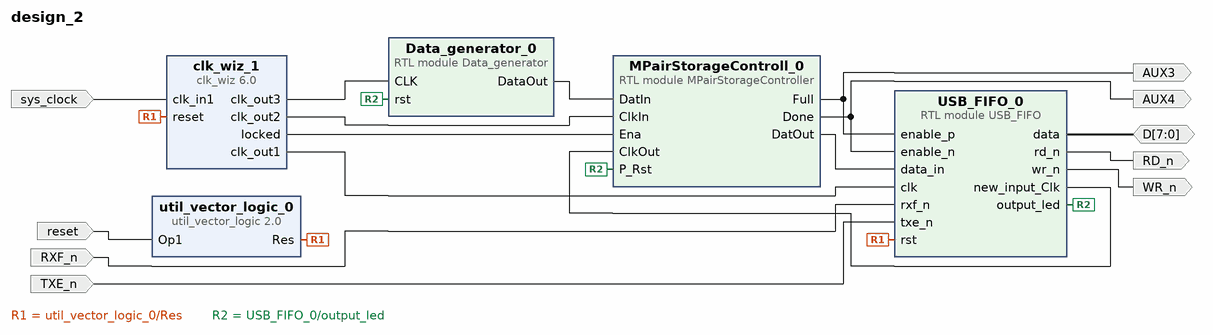
[diagram p0: block diagram of the top level]
# Vivado block design design_2, xc7a35tcsg324-2, Vivado 2019.1
create_bd_design design_2

create_bd_port -dir O AUX4
create_bd_port -dir I -type rst reset
set_property -dict {CONFIG.POLARITY ACTIVE_LOW} [get_bd_ports reset]
create_bd_port -dir I -type clk sys_clock
set_property -dict {CONFIG.FREQ_HZ 100000000 CONFIG.PHASE 0.000} [get_bd_ports sys_clock]
create_bd_port -dir O RD_n
create_bd_port -dir O WR_n
create_bd_port -dir I RXF_n
create_bd_port -dir I TXE_n
create_bd_port -dir IO -from 7 -to 0 D
create_bd_port -dir O AUX3

create_bd_cell -type ip -vlnv xilinx.com:ip:clk_wiz:6.0 clk_wiz_1
set_property -dict [list \
  CONFIG.CLKOUT1_JITTER 130.958 \
  CONFIG.CLKOUT1_REQUESTED_OUT_FREQ 100.000 \
  CONFIG.CLKOUT2_JITTER 159.371 \
  CONFIG.CLKOUT2_PHASE_ERROR 98.575 \
  CONFIG.CLKOUT2_REQUESTED_OUT_FREQ 40.000 \
  CONFIG.CLKOUT2_USED true \
  CONFIG.CLKOUT3_JITTER 159.371 \
  CONFIG.CLKOUT3_PHASE_ERROR 98.575 \
  CONFIG.CLKOUT3_REQUESTED_OUT_FREQ 40.000 \
  CONFIG.CLKOUT3_REQUESTED_PHASE 90 \
  CONFIG.CLKOUT3_USED true \
  CONFIG.CLK_IN1_BOARD_INTERFACE sys_clock \
  CONFIG.MMCM_CLKOUT0_DIVIDE_F 10.000 \
  CONFIG.MMCM_CLKOUT1_DIVIDE 25 \
  CONFIG.MMCM_CLKOUT2_DIVIDE 25 \
  CONFIG.MMCM_CLKOUT2_PHASE 90.000 \
  CONFIG.NUM_OUT_CLKS 3 \
  CONFIG.RESET_BOARD_INTERFACE reset \
  CONFIG.RESET_PORT reset \
  CONFIG.RESET_TYPE ACTIVE_HIGH \
  CONFIG.USE_BOARD_FLOW true \
] [get_bd_cells clk_wiz_1]
create_bd_cell -type ip -vlnv xilinx.com:ip:util_vector_logic:2.0 util_vector_logic_0
set_property -dict {CONFIG.C_OPERATION not CONFIG.C_SIZE 1} [get_bd_cells util_vector_logic_0]
create_bd_cell -type module -reference MPairStorageController MPairStorageControll_0
set_property -dict {CONFIG.record_delay 10 CONFIG.rep_delay 6000 CONFIG.width 12} [get_bd_cells MPairStorageControll_0]
create_bd_cell -type module -reference USB_FIFO USB_FIFO_0
create_bd_cell -type module -reference Data_generator Data_generator_0

# ---- connections ----

connect_bd_net [get_bd_pins Data_generator_0/DataOut] [get_bd_pins MPairStorageControll_0/DatIn]
connect_bd_net [get_bd_pins clk_wiz_1/clk_out2] [get_bd_pins MPairStorageControll_0/ClkIn]
connect_bd_net [get_bd_pins clk_wiz_1/clk_out3] [get_bd_pins Data_generator_0/CLK]
connect_bd_net [get_bd_pins clk_wiz_1/locked] [get_bd_pins MPairStorageControll_0/Ena]
connect_bd_net [get_bd_ports reset] [get_bd_pins util_vector_logic_0/Op1]
connect_bd_net [get_bd_ports sys_clock] [get_bd_pins clk_wiz_1/clk_in1]
connect_bd_net [get_bd_pins util_vector_logic_0/Res] [get_bd_pins clk_wiz_1/reset] [get_bd_pins USB_FIFO_0/rst]
connect_bd_net [get_bd_pins USB_FIFO_0/rd_n] [get_bd_ports RD_n]
connect_bd_net [get_bd_pins USB_FIFO_0/wr_n] [get_bd_ports WR_n]
connect_bd_net [get_bd_ports RXF_n] [get_bd_pins USB_FIFO_0/rxf_n]
connect_bd_net [get_bd_ports TXE_n] [get_bd_pins USB_FIFO_0/txe_n]
connect_bd_net [get_bd_pins clk_wiz_1/clk_out1] [get_bd_pins USB_FIFO_0/clk]
connect_bd_net [get_bd_ports D] [get_bd_pins USB_FIFO_0/data]
connect_bd_net [get_bd_pins USB_FIFO_0/new_input_Clk] [get_bd_pins MPairStorageControll_0/ClkOut]
connect_bd_net [get_bd_pins USB_FIFO_0/output_led] [get_bd_pins MPairStorageControll_0/P_Rst] [get_bd_pins Data_generator_0/rst]
connect_bd_net [get_bd_pins MPairStorageControll_0/Full] [get_bd_ports AUX3] [get_bd_pins USB_FIFO_0/enable_p]
connect_bd_net [get_bd_pins MPairStorageControll_0/Done] [get_bd_ports AUX4] [get_bd_pins USB_FIFO_0/enable_n]
connect_bd_net [get_bd_pins MPairStorageControll_0/DatOut] [get_bd_pins USB_FIFO_0/data_in]

validate_bd_design
save_bd_design
